# Altium schematic sheet air qulity monitor.SchDoc
size A4
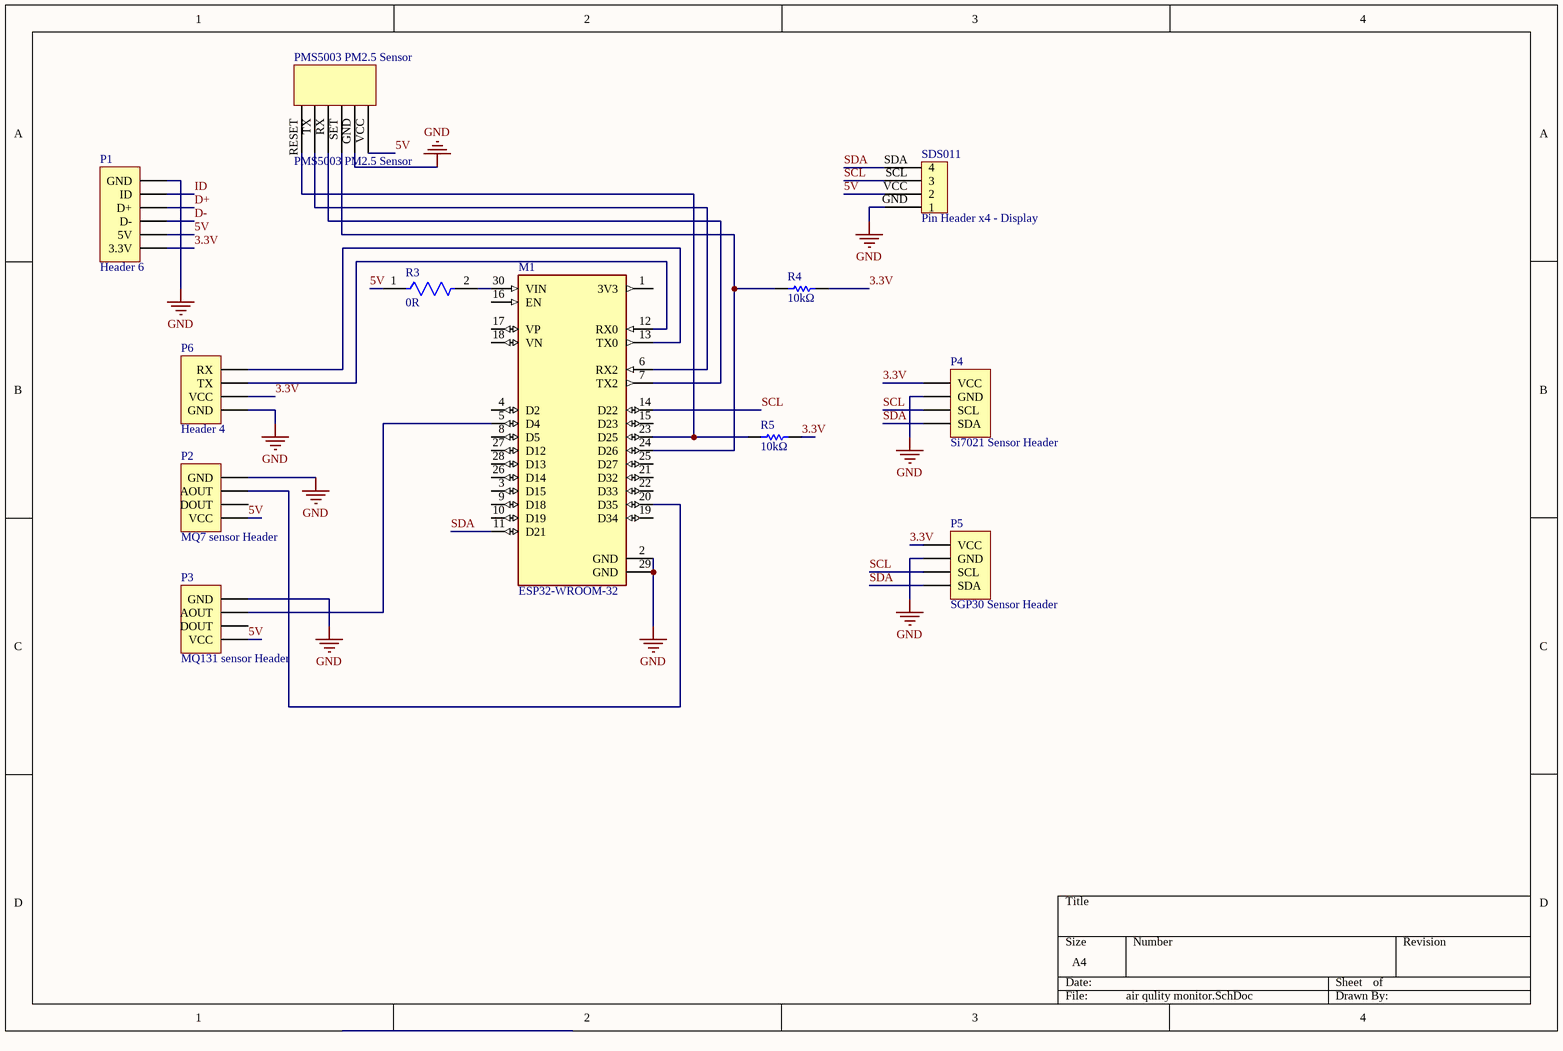
[diagram p0: air qulity monitor.SchDoc]

## Parts
M1  ESP32-WROOM-32  [ESP32-DEVKIT-V1]
P1  Header 6  [HDR1X6]
P2  MQ7 sensor Header  [HDR1X4]
P3  MQ131 sensor Header  [HDR1X4]
P4  Si7021 Sensor Header  [HDR1X4]
P5  SGP30 Sensor Header  [HDR1X4]
P6  Header 4  [HDR1X4]
PMS5003_PM2.5_Sensor  PMS5003 PM2.5 Sensor  [PMS5003 PM2.5 Sensor]
R3  0R  [FP-RC0402-0_4-IPC_A]
R4  10kΩ  [RESC1005X40X25LL05T10]
R5  10kΩ  [RESC1005X40X25LL05T10]
SDS011  Pin Header x4 - Display  [dispay]

## Nets
GND: M1.2(GND) M1.29(GND) P1.6(GND) P2.4(GND) P3.4(GND) P4.2(GND) P5.2(GND) P6.1(GND) PMS5003_PM2.5_Sensor.GND SDS011.GND(1)
3.3V : P1.1(3.3V) P4.1(VCC) P5.1(VCC) P6.2(VCC) R4.2 R5.2
5V: P1.2(5V) P2.1(VCC) P3.1(VCC) PMS5003_PM2.5_Sensor.VCC R3.1 SDS011.VCC(2)
D+: P1.4(D+)
D-: P1.3(D-)
ID: P1.5(ID)
SCL: M1.14(D22) P4.3(SCL) P5.3(SCL) SDS011.SCL(3)
SDA: M1.11(D21) P4.4(SDA) P5.4(SDA) SDS011.SDA(4)
NetM1_5: M1.5(D4) P3.3(AOUT)
NetM1_6: M1.6(RX2) PMS5003_PM2.5_Sensor.TX
NetM1_7: M1.7(TX2) PMS5003_PM2.5_Sensor.RX
NetM1_12: M1.12(RX0) P6.3(TX)
NetM1_13: M1.13(TX0) P6.4(RX)
NetM1_20: M1.20(D35) P2.3(AOUT)
NetM1_23: M1.23(D25) PMS5003_PM2.5_Sensor.RESET R5.1
NetM1_24: M1.24(D26) PMS5003_PM2.5_Sensor.SET R4.1
NetM1_30: M1.30(VIN) R3.2

Not connected (* = marked no-connect by the designer): M1 1(3V3) 3(D15) 4(D2) 8(D5) 9(D18) 10(D19) 15(D23) 16(EN) 17(VP) 18(VN) 19(D34) 21(D32) 22(D33) 25(D27) 26(D14) 27(D12) 28(D13); P2 2(DOUT); P3 2(DOUT)

## Library data of the parts
M1 = ESP32-DEVKIT-V1: Dual core, Wi-Fi: 2.4 GHz up to 150 Mbits/s,BLE (Bluetooth Low Energy) and legacy Bluetooth, 32 bits, Up to 240 MHz
P1 = Header 6: Header, 6-Pin; LatestRevisionDate: 17-Jul-2002; LatestRevisionNote: Re-released for DXP Platform.; Publisher: Altium Limited
P2-P6 = Header 4: Header, 4-Pin; LatestRevisionDate: 17-Jul-2002; LatestRevisionNote: Re-released for DXP Platform.; Publisher: Altium Limited
R3 = CMP-2002-07342-2: RES SMD 0 OHM JUMPER 1/16W 0402; Manufacturer: Yageo; Mfr. Part #: RC0402FR-070RL; value: 0R; Package: 0402; LCSC Part #: C106231; Datasheet: https://www.lcsc.com/product-detail/Chip-Resistor-Surface-Mount_YAGEO-RC0402FR-070RL_C106231.html
R4 R5 = CMP-2002-07353-1: 62.5mW 50V ±100ppm/℃ ±1% -55℃~+155℃ 10kΩ 0402 Chip Resistor - Surface Mount ROHS; Mfr. Part #: RC0402FR-0710KL; Manufacturer: Yageo / Phycomp; Datasheet: https://datasheet.lcsc.com/lcsc/1809301715_YAGEO-RC0402FR-0710KL_C60490.pdf; LCSC Part #: C60490; Package: 0402; value: 10kΩ